# EAGLE design Mabee_DAC GP8413 V1.1 (EAGLE 6.1)
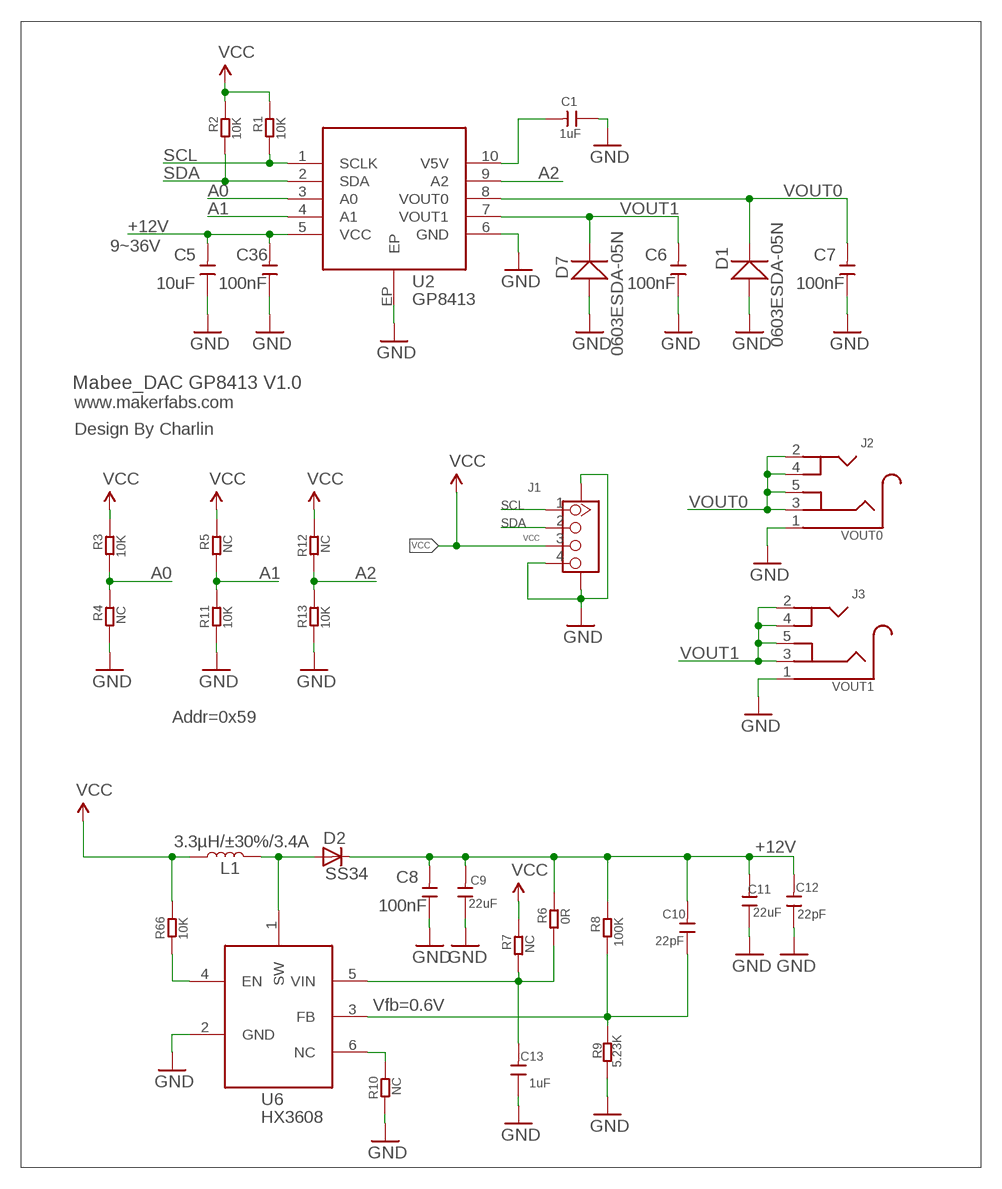
[diagram p0: schematic, sheet 1]

## Parts
C1  1uF  C-0603  [0603]
C5  10uF  C-0603  [0603]
C6  100nF  C-0603  [0603]
C7  100nF  C-0603  [0603]
C8  100nF  C-0603  [0603]
C9  22uF  DISCRETE_C-0805  [DISCRETE_C0805]
C10  22pF  C-0603  [0603]
C11  22uF  DISCRETE_C-0805  [DISCRETE_C0805]
C12  22pF  C-0603  [0603]
C13  1uF  C-0603  [0603]
C36  100nF  C-0603  [0603]
D1  0603ESDA-05N  DISCRETE_D0603  [DISCRETE_SOD523]
D2  SS34  DIODE-DO-214AC  [DO-214AC]
D7  0603ESDA-05N  DISCRETE_D0603  [DISCRETE_SOD523]
J1  GROVE-CONNECTOR-SMD'90D'  [HW4-SMD-2.0-90D]
L1  3.3µH/±30%/3.4A  INDUCTOR-CR54-3.3UH  [CR54]
R1  10K  R-0603  [R0603]
R2  10K  R-0603  [R0603]
R3  10K  R-0603  [R0603]
R4  NC  R-0603  [R0603]
R5  NC  R-0603  [R0603]
R6  0R  R-0603  [R0603]
R7  NC  R-0603  [R0603]
R8  100K  R-0603  [R0603]
R9  5.23K  R-0603  [R0603]
R10  NC  R-0603  [R0603]
R11  10K  R-0603  [R0603]
R12  NC  R-0603  [R0603]
R13  10K  R-0603  [R0603]
R66  10K  R-0603  [R0603]
U2  GP8413  [ESOP-10-EP-150MIL]
U6  HX3608  [SOT-23-6]
VOUT0  J2  AUDIO_3.5MMJACK  [4UCONN_19269]
VOUT1  J3  AUDIO_3.5MMJACK  [4UCONN_19269]

## Nets
+12V: C5.2 C8.2 C9.2 C10.2 C11.2 C12.2 C36.2 D2.C R6.2 R8.2 U2.5(VCC)
A0: R3.1 R4.2 U2.3(A0)
A1: R5.1 R11.2 U2.4(A1)
A2: R12.1 R13.2 U2.9(A2)
ENABLE: R66.1 U6.4(EN)
GND: C1.1 C5.1 C6.1 C7.1 C8.1 C9.1 C11.1 C12.1 C13.1 C36.1 D1.+ D7.+ J1.4 J1.SS1 J1.SS2 R4.1 R9.1 R10.1 R11.1 R13.1 U2.6(GND) U2.EP U6.2(GND) VOUT0.1 VOUT1.1
N$2: C1.2 U2.10(V5V)
N$3: C13.2 R6.1 R7.1 U6.5(VIN)
N$4: C10.1 R8.1 R9.2 U6.3(FB)
N$5: R10.2 U6.6(NC)
N$20: D2.A L1.P$2 U6.1(SW)
SCL: J1.1 R1.1 U2.1(SCLK)
SDA: J1.2 R2.1 U2.2(SDA)
VCC: J1.3 L1.P$1 R1.2 R2.2 R3.2 R5.2 R7.2 R12.2 R66.2
VOUT0: C7.2 D1.- U2.8(VOUT0) VOUT0.2 VOUT0.3 VOUT0.4 VOUT0.5
VOUT1: C6.2 D7.- U2.7(VOUT1) VOUT1.2 VOUT1.3 VOUT1.4 VOUT1.5

## Notes on the sheet
- 9~36V
- Mabee_DAC GP8413 V1.0
- www.makerfabs.com
- Design By Charlin
- Addr=0x59
- Vfb=0.6V

## Library data of the parts
C1 C5-C8 C10 C12 C13 C36 = Discrete:C*: Ceramic Capacitors
C9 C11 = A9G:DISCRETE_C*: Ceramic Capacitors
D1 D7 = L:DISCRETE_D*
D2 = diode:DIODE-: DIODE
J1 = Connector-new:GROVE-CONNECTOR-SMD: 4P-SMD-2.0:320110030;4P-SMD-2.0-90D:320110032
L1 = SparkFun-Coils:INDUCTOR: Inductors Resist changes in electrical current. Basically a coil of wire. SparkFun Products: SparkFun Load Cell Amplifier - HX711 <https://www.sparkfun.com/products/13879> IOIO-OTG - V2.2 <https://www.sparkfun.com/products/13613>; PROD_ID: NDUC-11157
R1-R13 R66 = Discrete:R*
U2 = sale:GP8413
U6 = self:HX3608
VOUT0 VOUT1 = microbuilder:AUDIO_3.5MMJACK: 3.5MM Audio Jack These are normally connected as follows, from left-to right on the schematic symbol above: Tip: Left Audio Inner Ring: Right Audio Shell: Common/GND

## Net classes
0 default: width 0.203 mm, drill 0.305 mm, clearance 0.152 mm

## Board
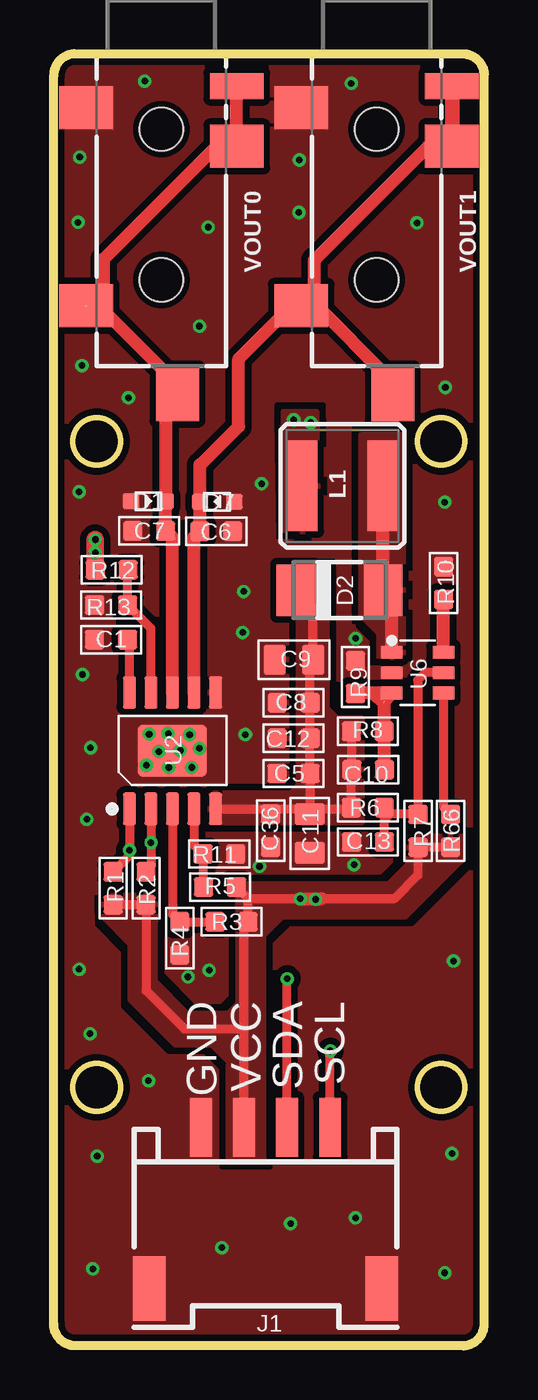
[diagram p1: board, top side]
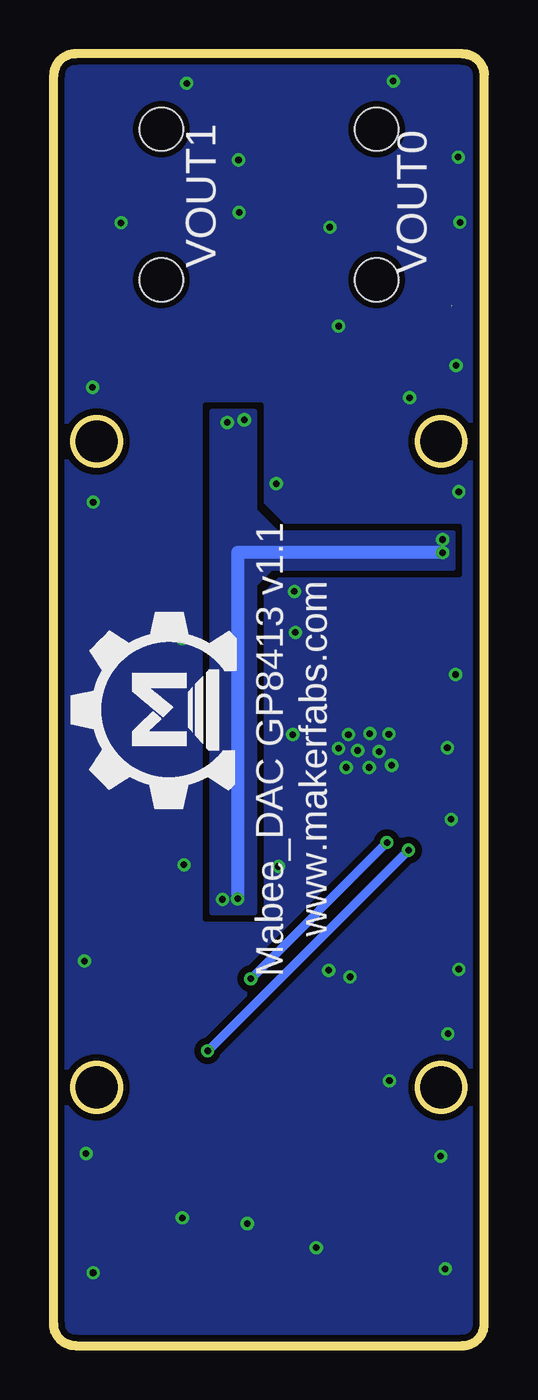
[diagram p2: board, bottom side, seen from below]

Size 20 x 60 mm. Coordinates in mm from the lower left corner, seen from the top.
Outline: 19,0 1,0 arc-90 0,1 0,59 arc-90 1,60 19,60 arc-90 20,59 20,1 arc-90 19,0
Outline: circle at 2,12 radius 1.1
Outline: circle at 18,12 radius 1.1
Outline: circle at 2,42 radius 1.1
Outline: circle at 18,42 radius 1.1
Copper layers (1*16): Top 0.035mm / dielectric 1.5mm / Bottom 0.035mm
Design rules: minimum track width 10mil, minimum drill 10mil, track to track 8mil, track to pad 8mil, pad to pad 8mil, via to via 8mil, smd to smd 0mil, copper to edge 10mil, drill to drill 8mil, minimum pad ring 10mil, minimum via ring 6mil, stop-mask expansion 4mil, vias tented up to drill 100mil, thermal gap 0mil

### Footprints (pad centres in the part's own frame; a part is rotated, then mirrored left to right if it is on the bottom)
0603 = smd 0.889 x 0.889: 1 -0.762,0; 2 0.762,0
DISCRETE_C0805 = smd 1.016 x 1.397: 1 -0.889,0; 2 0.889,0
DISCRETE_SOD523 = smd 0.762 x 0.7: + -0.8,0; - 0.8,0
DO-214AC = smd 1.8 x 2.4: A 2.025,0; C -2.025,0
HW4-SMD-2.0-90D = smd 1.01 x 2.74: 1 -3,-0.1; 2 -1,-0.1; 3 1,-0.1; 4 3,-0.1 | smd 1.5 x 3: SS1 -5.4,7.4; SS2 5.4,7.4
CR54 = smd 4.2 x 1.4: P$1 0,1.85; P$2 0,-1.85
R0603 = smd 0.889 x 0.889: 1 -0.762,0; 2 0.762,0
ESOP-10-EP-150MIL = smd 1.5 x 0.6: 1 -2.7,2; 2 -2.7,1; 3 -2.7,0; 4 -2.7,-1; 5 -2.7,-2; 6 2.7,-2; 7 2.7,-1; 8 2.7,0; 9 2.7,1; 10 2.7,2 | smd 2.4 x 3.2: EP 0,0
SOT-23-6 = smd 1 x 0.6: 1 -1.2,0.95; 2 -1.2,0; 3 -1.2,-0.95; 4 1.2,-0.95; 5 1.2,0; 6 1.2,0.95
4UCONN_19269 = smd 2 x 2.5: 1 2.5,-3.5; 2 11.7,-3.5; 3 4.3,3.5 | smd 2.5 x 2: 4 15.8,0.75 | smd 1.2 x 2.5: 5 1.5,3.5 | hole 2: 3.5,0; 10.5,0

### Placement (x,y rotation side)
C1  2.66,32.79 0 top
C5  11.14,26.58 0 top
C6  7.55,37.82 180 top
C7  4.44,37.84 0 top
C8  11.15,29.86 0 top
C9  11.16,31.86 0 top
C10  14.61,26.75 180 top
C11  11.9,23.79 90 top
C12  11.15,28.21 0 top
C13  14.6,23.39 0 top
C36  10.08,23.92 90 top
D1  4.4,39.22 0 top
D2  13.28,35.08 0 top
D7  7.59,39.2 180 top
J1  9.84,10.05 180 top
L1  13.41,39.93 90 top
R1  2.76,21.25 270 top
R2  4.29,21.25 270 top
R3  8.26,19.69 0 top
R4  5.86,18.93 90 top
R5  7.72,21.3 0 top
R6  14.59,24.99 180 top
R7  16.93,23.91 270 top
R8  14.59,28.53 180 top
R9  14.02,31.05 270 top
R10  18.12,35.42 270 top
R11  7.69,22.84 180 top
R12  2.69,36.04 180 top
R13  2.67,34.4 0 top
R66  18.44,23.91 270 top
U2  5.52,27.64 90 top
U6  16.91,31.25 0 top
U$1  [MAKERFABS_0.3]  11.58,25.41 90 bottom
VOUT0  5,60 270 top
VOUT1  15,60 270 top

### Tracks (layer width: path | path; a pad name or v marks a point on that pad's centre or on a via)
+12V
  Top 0.406: U2.5 10.24,24.94 | 10.24,24.94 11.96,24.94 | 11.96,24.94 13.78,24.94 R6.2 13.83,26.73 C10.2 13.85,28.51 R8.2 | 11.96,24.94 11.9,24.87 C11.2 C5.2 C12.2 C8.2 11.91,31.72 C9.2 12.05,34.29 D2.C | C36.2 10.07,24.77 10.24,24.94
  pour Top: 7.26,25.68 11.02,25.68 11.38,26.04 11.38,36.14 12.7,36.14 12.7,29.59 13.16,29.13 14.33,29.13 14.33,24.31 7.26,24.31
A0
  Top 0.406: U2.3 5.52,20.03 R4.2 R3.1
A1
  Top 0.406: U2.4 6.52,23.25 R11.2 6.93,21.33 R5.1
A2
  Top 0.406: U2.9 4.52,33.32 R13.2 3.43,36.02 R12.1
ENABLE
  Top 0.406: U6.4 18.11,25 R66.1
GND  (via drill 0.3)
  other vias: 11.01,5.67 14.02,5.94 6.23,17.13 1.18,17.48 2.02,8.8 18.5,8.92 18.58,17.86 13.95,22.33 8.9,28.38 1.71,27.77 1.33,31.17 8.82,35.03 8.77,33.13 3.46,44.03 1.18,39.66 9.66,40.04 1.13,52.18 4.23,58.73 1.3,45.52 13.83,58.63 11.41,55.07 18.2,44.51 18.17,39.17 16.87,52.15 14.03,32.85 9.56,22.26 7.22,17.43 1.69,14.49 4.4,12.3 7.81,4.55 1.81,3.56 18.17,3.39 4.43,28.4 5.32,28.43 6.31,28.38 6.77,27.74 5.88,27.64 4.89,27.59 4.3,26.96 5.34,26.86 6.41,26.86 1.53,24.44 6.77,47.35 1.2,55.2 7.17,51.95 11.39,52.64
  pour Top (isolate 0.305, rank 6): 21.6,65 21.6,-2 -2.3,-2 -2.3,65
  pour Bottom (isolate 0.305, rank 6): 22,64 22,-2.4 -2.7,-2.4 -2.7,64
N$2
  Top 0.406: U2.10 3.52,32.7 C1.2
N$3
  Top 0.406: U6.5 17.26,31.25 16.92,30.91 16.92,24.68 | 16.92,24.68 R7.1 | C13.2 15.36,24.43 | 15.36,24.43 15.36,24.98 R6.1 | 16.92,24.68 15.61,24.68 15.36,24.43
N$4  (1 unrouted)
  Top 0.61: C10.1 15.37,28.51 | R9.2 14.04,30.3 U6.3 15.35,29.95 R8.1 | 15.34,29.84 14.91,30.28 14.91,30.3
  Top 0.813: 15.37,28.51 R8.1
N$5
  Top 0.61: U6.6 18.11,34.65 R10.2
N$20
  Top 0.61: L1.P$2 15.26,35.13 D2.A 15.71,34.68 U6.1
  pour Top: 16.26,31.95 16.26,42.29 14.55,42.29 14.27,42.29 14.27,33.93 15.11,33.1 15.11,31.95
SCL  (via drill 0.3)
  Top 0.406: U2.1 v3.52,23.01 3.52,22.77 R1.1 | J1.1 v12.84,13.68 v12.85,13.69
  Bottom 0.406: v12.85,13.69 12.85,13.68 v3.52,23.01
SDA  (via drill 0.3)  (1 unrouted)
  Top 0.406: U2.2 v4.52,23.37 4.52,22.24 R2.1 | J1.2 v10.84,17.04 v10.85,17.04
  Bottom 0.406: v10.85,17.04 v4.52,23.37
VCC  (via drill 0.3)
  Top 0.406: R66.2 R7.2 16.93,21.86 15.82,20.75 12.42,20.75 | 9.02,20.77 R3.2 8.84,19.51 8.84,14.71 | 9.02,20.77 R5.2 | v11.46,20.75 9.04,20.75 9.02,20.77 | R1.2 R2.2 4.29,16.49 6.07,14.71 8.84,14.71 | J1.3 8.84,14.71
  Top 0.61: 11.46,40.03 L1.P$1 11.46,40.04 | v11.46,20.75 12.42,20.75 | v1.93,37.44 v1.93,36.83
  Top 0.813: R12.2 v1.93,37.44
  Bottom 0.61: v11.46,20.75 11.46,36.85 11.43,36.83 v1.93,36.83
  other vias: 11.15,43 12.17,20.73 11.94,42.88
  pour Top: 10.67,43.38 10.77,37.82 12.32,37.82 12.22,43.38
  pour Top: 16.46,23.65 16.46,22.33 15.57,21.44 8.56,21.44 8.56,15.88 8.13,15.44 6.17,15.44 4.7,16.92 4.7,20.9 2.31,20.9 2.31,19.91 3.56,18.67 3.56,16.46 3.56,16.08 5.66,13.97 7.37,13.97 8.13,13.21 8.13,8.61 9.55,8.61 9.75,8.61 9.75,17.4 9.75,19.05 10.62,19.91 16.31,19.91 18.97,22.58 18.97,23.6 18.97,23.65
  pour Bottom: 12.65,20.12 12.65,43.38 10.67,43.38 10.67,38.76 9.65,37.74 1.45,37.74 1.45,36.12 9.93,36.12 10.67,35.38 10.67,20.12
VOUT0  (1 unrouted)
  Top 0.406: 2.31,48.08 1.47,48.08 1.47,48.23 1.5,48.23 1.5,48.28 | 1.5,48.28 1.52,48.28 1.52,48.34 1.5,48.34 1.5,48.28
  Top 0.61: U2.8 5.52,37.52 C7.2 D1.- 5.21,39.23 5.21,45.16 | VOUT0.5 VOUT0.3 7.75,55.8 7.7,55.85 2.31,50.47 2.31,48.08 5.21,45.19 5.21,45.16 | VOUT0.4 5.26,44.97 5.26,45.11 5.21,45.16
VOUT1
  Top 0.61: U2.7 6.52,37.55 C6.2 D7.- 6.79,40.91 8.59,42.7 8.59,45.82 11,48.23 11.35,48.23 VOUT1.2 12.11,48.42 | 12.11,48.42 15.67,44.86 15.67,44.44 VOUT1.4 | 12.11,48.42 12.11,50.41 17.37,55.68 18.47,55.68 18.57,55.78 18.57,55.83 | 18.57,55.83 18.57,58.4 18.47,58.5 18.47,56.59 18.54,56.52 | VOUT1.5 VOUT1.3 18.56,55.82 18.57,55.83

### Text on the board
tPlace: GND | VCC | SDA | SCL
bPlace: VOUT0 | VOUT1 | www.makerfabs.com | Mabee_DAC GP8413 v1.1